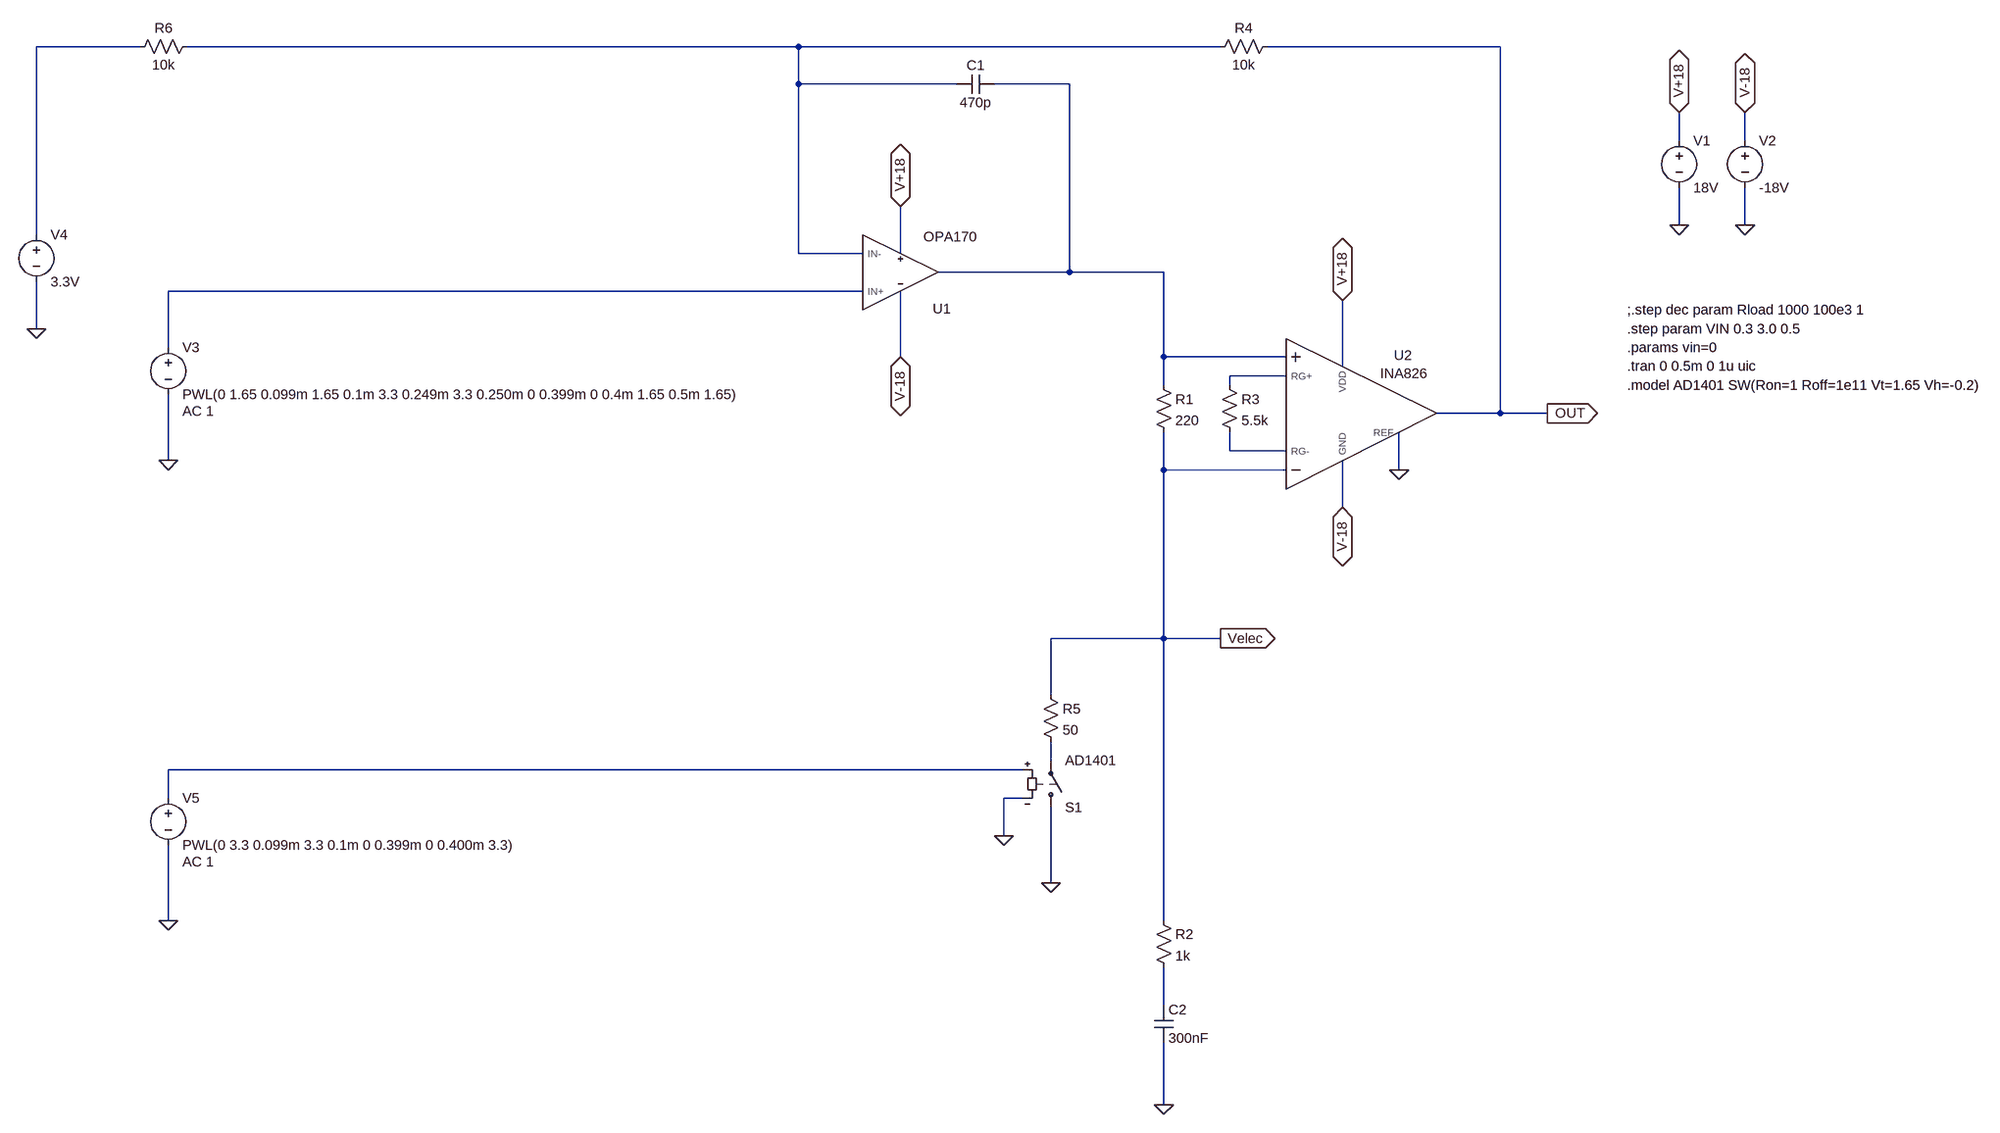
[diagram p0: schematic estim-tran.asc]
estim-tran.asc, the LTspice schematic file:
Version 4
SHEET 1 2092 1652
WIRE -1824 -240 -2000 -240
WIRE -544 -240 -1744 -240
WIRE 288 -240 -544 -240
WIRE 1056 -240 368 -240
WIRE -544 -176 -544 -240
WIRE -160 -176 -544 -176
WIRE 32 -176 -96 -176
WIRE 1360 -80 1360 -128
WIRE 1472 -80 1472 -128
WIRE 1360 64 1360 0
WIRE 1472 64 1472 0
WIRE -2000 80 -2000 -240
WIRE -544 112 -544 -176
WIRE -320 112 -544 112
WIRE -256 112 -256 32
WIRE 32 144 32 -176
WIRE 32 144 -192 144
WIRE 192 144 32 144
WIRE -320 176 -1776 176
WIRE -2000 240 -2000 160
WIRE -1776 272 -1776 176
WIRE -256 288 -256 176
WIRE 192 288 192 144
WIRE 400 288 192 288
WIRE 496 304 496 192
WIRE 400 320 304 320
WIRE 192 336 192 288
WIRE 304 336 304 320
WIRE 1056 384 1056 -240
WIRE 1056 384 656 384
WIRE 1136 384 1056 384
WIRE 304 448 304 416
WIRE 400 448 304 448
WIRE -1776 464 -1776 352
WIRE 192 480 192 416
WIRE 400 480 192 480
WIRE 592 480 592 416
WIRE 496 544 496 464
WIRE 192 800 192 480
WIRE 192 800 0 800
WIRE 288 800 192 800
WIRE 0 896 0 800
WIRE 0 1008 0 976
WIRE -48 1024 -1776 1024
WIRE -1776 1072 -1776 1024
WIRE -48 1072 -80 1072
WIRE -80 1136 -80 1072
WIRE 0 1216 0 1088
WIRE -1776 1280 -1776 1152
WIRE 192 1280 192 800
WIRE 192 1424 192 1360
WIRE 192 1632 192 1488
FLAG -256 32 V+18
IOPIN -256 32 BiDir
FLAG -256 288 V-18
IOPIN -256 288 BiDir
FLAG 496 192 V+18
IOPIN 496 192 BiDir
FLAG 496 544 V-18
IOPIN 496 544 BiDir
FLAG 1360 64 0
FLAG 1472 64 0
FLAG 1360 -128 V+18
IOPIN 1360 -128 BiDir
FLAG 1472 -128 V-18
IOPIN 1472 -128 BiDir
FLAG -1776 464 0
FLAG 1136 384 OUT
IOPIN 1136 384 Out
FLAG -2000 240 0
FLAG 592 480 0
FLAG 192 1632 0
FLAG -80 1136 0
FLAG 0 1216 0
FLAG -1776 1280 0
FLAG 288 800 Velec
IOPIN 288 800 Out
SYMBOL res 176 320 R0
SYMATTR InstName R1
SYMATTR Value 220
SYMBOL voltage 1360 -96 R0
WINDOW 123 0 0 Left 2
WINDOW 39 0 0 Left 2
SYMATTR InstName V1
SYMATTR Value 18V
SYMBOL voltage 1472 -96 R0
WINDOW 123 0 0 Left 2
WINDOW 39 0 0 Left 2
SYMATTR InstName V2
SYMATTR Value -18V
SYMBOL res 176 1264 R0
SYMATTR InstName R2
SYMATTR Value 1k
SYMBOL res 288 320 R0
SYMATTR InstName R3
SYMATTR Value 5.5k
SYMBOL cap -96 -192 R90
WINDOW 0 0 32 VBottom 2
WINDOW 3 32 32 VTop 2
SYMATTR InstName C1
SYMATTR Value 470p
SYMBOL res 384 -256 R90
WINDOW 0 0 56 VBottom 2
WINDOW 3 32 56 VTop 2
SYMATTR InstName R4
SYMATTR Value 10k
SYMBOL voltage -1776 256 R0
WINDOW 123 24 124 Left 2
WINDOW 39 0 0 Left 2
SYMATTR Value2 AC 1
SYMATTR InstName V3
SYMATTR Value PWL(0 1.65 0.099m 1.65 0.1m 3.3 0.249m 3.3 0.250m 0 0.399m 0 0.4m 1.65 0.5m 1.65)
SYMBOL voltage -2000 64 R0
WINDOW 123 0 0 Left 2
WINDOW 39 0 0 Left 2
SYMATTR InstName V4
SYMATTR Value 3.3V
SYMBOL res -1728 -256 R90
WINDOW 0 0 56 VBottom 2
WINDOW 3 32 56 VTop 2
SYMATTR InstName R6
SYMATTR Value 10k
SYMBOL cap 176 1424 R0
SYMATTR InstName C2
SYMATTR Value 300nF
SYMBOL sw 0 1104 M180
SYMATTR InstName S1
SYMATTR Value AD1401
SYMBOL INA826 496 384 R0
SYMATTR InstName U2
SYMBOL opa170 -256 144 M180
SYMATTR InstName U1
SYMBOL res -16 880 R0
SYMATTR InstName R5
SYMATTR Value 50
SYMBOL voltage -1776 1056 R0
WINDOW 123 24 124 Left 2
WINDOW 39 0 0 Left 2
SYMATTR Value2 AC 1
SYMATTR InstName V5
SYMATTR Value PWL(0 3.3 0.099m 3.3 0.1m 0 0.399m 0 0.400m 3.3)
TEXT 1272 304 Left 2 !.tran 0 0.5m 0 1u uic
TEXT 1272 272 Left 2 !.params vin=0
TEXT 1272 240 Left 2 !.step param VIN 0.3 3.0 0.5
TEXT 1272 208 Left 2 !;.step dec param Rload 1000 100e3 1
TEXT 1272 336 Left 2 !.model AD1401 SW(Ron=1 Roff=1e11 Vt=1.65 Vh=-0.2)

The netlist it stands for:
* estim-tran.asc
R1 N003 Velec 220
V1 V+18 0 18V
V2 V-18 0 -18V
R2 Velec N009 1k
R3 N005 N006 5.5k
C1 N003 N002 470p
R4 OUT N002 10k
V3 N004 0 PWL(0 1.65 0.099m 1.65 0.1m 3.3 0.249m 3.3 0.250m 0 0.399m 0 0.4m 1.65 0.5m 1.65) AC 1
V4 N001 0 3.3V
R6 N002 N001 10k
C2 N009 0 300nF
S1 0 N007 N008 0 AD1401
XU2 N003 Velec V+18 V-18 OUT 0 N006 N005 INA826  ; pins IN+ IN- VDD GND OUT REF RG- RG+
XU1 N004 N002 V+18 V-18 N003 OPA170  ; pins IN+ IN- VCC VEE OUT
R5 Velec N007 50
V5 N008 0 PWL(0 3.3 0.099m 3.3 0.1m 0 0.399m 0 0.400m 3.3) AC 1
.tran 0 0.5m 0 1u uic
.params vin=0
.step param VIN 0.3 3.0 0.5
;.step dec param Rload 1000 100e3 1
.model AD1401 SW(Ron=1 Roff=1e11 Vt=1.65 Vh=-0.2)
.lib INA826.lib
.lib OPA170.lib
.backanno
.end